# Altium project ArduinoUnoSheild.PrjPcb
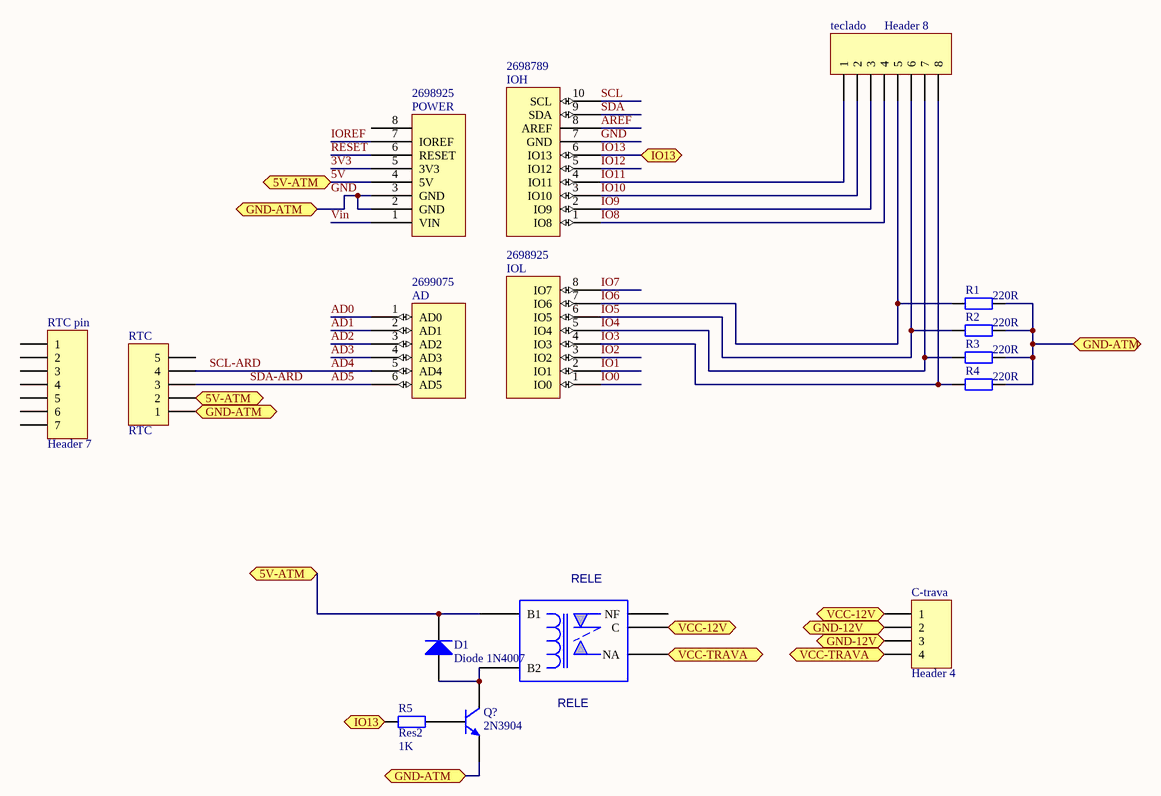
[diagram p0: ArduinoUnoShield.SchDoc]
1 sheet, 16 parts. Net scope: flat (ports and power ports of the same name join across sheets).
Board file: ArduinoUnoShield.PcbDoc

## Sheet ArduinoUnoShield.SchDoc
size A4

### Parts
AD  Supplier Part Number 4: 2699075  [Header 6x1 8.5mm]  (hidden comment: AD)
C-trava  Header 4  [HDR1X4]
D1  Diode 1N4007  [DO-41]
IOH  Supplier Part Number 3: 2698789  [Header 10x1 8.5mm]  (hidden comment: IOH)
IOL  Supplier Part Number 4: 2698925  [Header 8x1 8.5mm]  (hidden comment: IOL)
POWER  Supplier Part Number 4: 2698925  [Header 8x1 8.5mm]  (hidden comment: POWER_UNO)
Q?  2N3904  [TO-92A]
R1  value 220R  [AXIAL-0.4]  (hidden comment: 220)
R2  value 220R  [AXIAL-0.4]
R3  value 220R  [AXIAL-0.4]
R4  value 220R  [AXIAL-0.4]
R5  Res2  value 1K  [AXIAL-0.4]
RELE  RELE  [RELE]
RTC  RTC  [HDR1X5]
RTC_pin  Header 7  [HDR1X7]
teclado  Header 8  [HDR1X8]

### Ports
5V-ATM, GND-12V, GND-ATM, IO13, VCC-12V, VCC-TRAVA

### Nets
3V3: POWER.5(3V3)
5V: D1.2(K) POWER.4(5V) RELE.1(B1) RTC.2 ; port 5V-ATM
AD0: AD.1(AD0)
AD1: AD.2(AD1)
AD2: AD.3(AD2)
AD3: AD.4(AD3)
AD4: AD.5(AD4) RTC.4  [also labelled SCL-ARD]
AD5: AD.6(AD5) RTC.3  [also labelled SDA-ARD]
AREF: IOH.8(AREF)
GND: IOH.7(GND)
IO0: IOL.1(IO0)
IO1: IOL.2(IO1)
IO2: IOL.3(IO2)
IO3: IOL.4(IO3) R4.1 teclado.8
IO4: IOL.5(IO4) R3.1 teclado.7
IO5: IOL.6(IO5) R2.1 teclado.6
IO6: IOL.7(IO6) R1.1 teclado.5
IO7: IOL.8(IO7)
IO8: IOH.1(IO8) teclado.4
IO9: IOH.2(IO9) teclado.3
IO10: IOH.3(IO10) teclado.2
IO11: IOH.4(IO11) teclado.1
IO12: IOH.5(IO12)
IO13: IOH.6(IO13) R5.1 ; port IO13
IOREF: POWER.7(IOREF)
RESET: POWER.6(RESET)
SCL: IOH.10(SCL)
SDA: IOH.9(SDA)
Vin: POWER.1(VIN)
NetC-trava_1: C-trava.1 RELE.4(C) ; port VCC-12V
NetC-trava_2: C-trava.2 C-trava.3 ; port GND-12V
NetC-trava_4: C-trava.4 RELE.5(NA) ; port VCC-TRAVA
NetD1_1: D1.1(A) Q?.3(C) RELE.2(B2)
NetPOWER_2: POWER.2(GND) POWER.3(GND) Q?.1(E) R1.2 R2.2 R3.2 R4.2 RTC.1 ; port GND-ATM
NetQ?_2: Q?.2(B) R5.2

Not connected (* = marked no-connect by the designer): POWER 8; RELE 3(NF); RTC 5; RTC_pin 1 2 3 4 5 6 7

### Notes on the sheet
- Labels drawn without touching a wire or pin: GND

### Library data of the parts
C-trava = Header 4: Header, 4-Pin; LatestRevisionDate: 17-Jul-2002; LatestRevisionNote: Re-released for DXP Platform.; Publisher: Altium Limited
D1 = Diode 1N4007: 1 Amp General Purpose Rectifier; Published: 8-Jun-2000; LatestRevisionDate: 17-Jul-2002; LatestRevisionNote: Re-released for DXP Platform.; DatasheetVersion: 1998; PackageVersion: Aug-1999; PackageReference: DO-41; Publisher: Altium Limited; PackageDescription: Diode, Axial; Body 5.2 x 2.7 mm (LxDia. max), Lead Dia. 0.86 mm (max); Code_JEDEC: DO-204-AL; ComponentLink1Description: Manufacturer Link; ComponentLink1URL: http://www.fairchildsemi.com/; ComponentLink2Description: Datasheet; ComponentLink2URL: http://www.fairchildsemi.com/ds/1N%2F1N4001.pdf
Q? = 2N3904: NPN General Purpose Amplifier; Published: 8-Jun-2000; LatestRevisionDate: 15-Jan-2003; LatestRevisionNote: PCB Footprint 'BCY-W3/D4.7' replaced; DatasheetVersion: 1997; PackageVersion: Sep-1998; PackageReference: TO-92A; Publisher: Altium Limited; PackageDescription: TO, Flat Index; 3 In-Line, Axial Leads; Body Dia. 4.5mm; Leads 0.51 x 0.48 mm (max); ComponentLink1Description: Manufacturer Link; ComponentLink1URL: http://www.fairchildsemi.com/; ComponentLink2Description: Datasheet; ComponentLink2URL: http://www.fairchildsemi.com/ds/2N%2F2N3904.pdf
R1-R5 = Res2: Resistor; Published: 8-Jun-2000; LatestRevisionDate: 17-Jul-2002; LatestRevisionNote: Re-released for DXP Platform.; PackageReference: AXIAL-0.4; Publisher: Altium Limited; PackageDescription: Axial Device, Thru-Hole; 2 Leads; 0.4 in Pin Spacing
RTC = Header 5: Header, 5-Pin; LatestRevisionDate: 17-Jul-2002; LatestRevisionNote: Re-released for DXP Platform.; Publisher: Altium Limited
RTC_pin = Header 7: Header, 7-Pin; LatestRevisionDate: 17-Jul-2002; LatestRevisionNote: Re-released for DXP Platform.; Publisher: Altium Limited
teclado = Header 8: Header, 8-Pin; LatestRevisionDate: 17-Jul-2002; LatestRevisionNote: Re-released for DXP Platform.; Publisher: Altium Limited
AD = AD: Supplier 1: Arrow; Supplier Part Number 1: 2699089; Supplier 2: Digi-Key; Supplier Part Number 2: SAM1198-06-ND; Supplier 3: Arrow; Supplier Part Number 3: 2699088; Supplier 4: Arrow
IOH = IOH: Supplier 1: Arrow; Supplier Part Number 1: 2698803S4475693N1004; Supplier 2: Digi-Key; Supplier Part Number 2: SAM1198-10-ND; Supplier 3: Arrow
IOL = IOL: Supplier 1: Digi-Key; Supplier Part Number 1: SAM1198-08-ND; Supplier 2: Arrow; Supplier Part Number 2: 2698939; Supplier 3: Arrow; Supplier Part Number 3: 2698940; Supplier 4: Arrow
POWER = POWER_UNO: Supplier 1: Digi-Key; Supplier Part Number 1: SAM1198-08-ND; Supplier 2: Arrow; Supplier Part Number 2: 2698939; Supplier 3: Arrow; Supplier Part Number 3: 2698940; Supplier 4: Arrow
RELE = RELE: Value: *